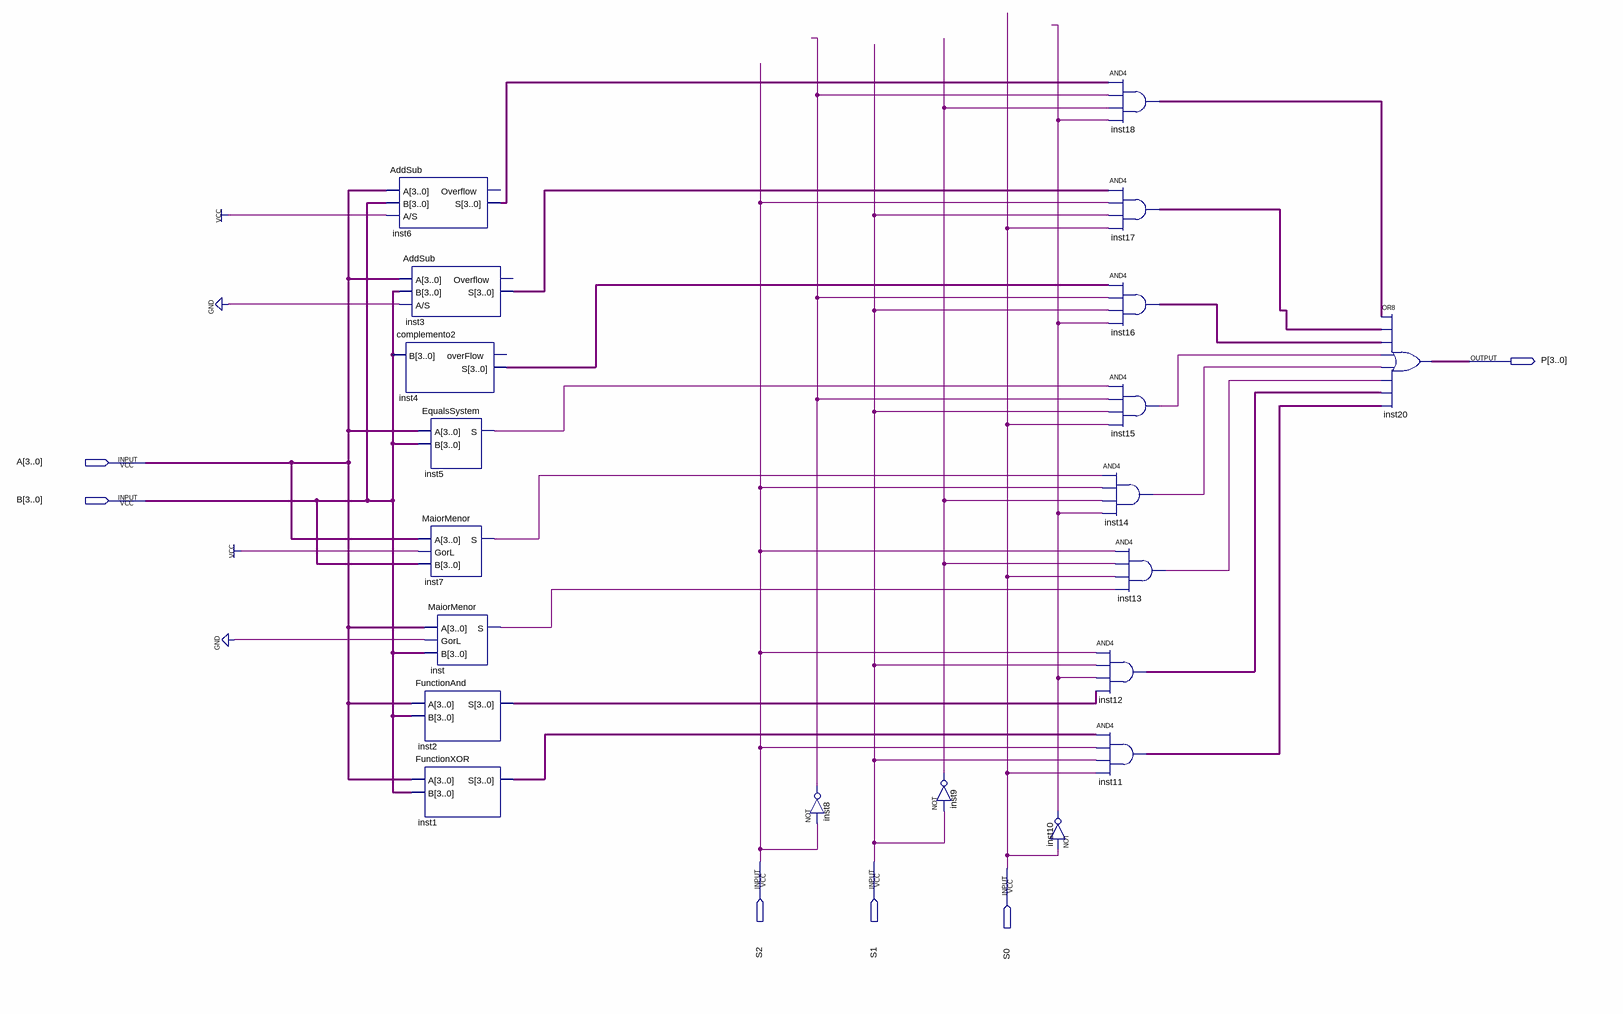
[diagram p0: schematic sheet]
// Quartus schematic Mux.bdf as structural Verilog: 20 symbols, 6 pins
module Mux (
  input  [3:0] A,
  input  [3:0] B,
  input  S2,
  input  S1,
  input  S0,
  output [3:0] P
);

  wire inst5_s, inst7_s, inst8_out, inst9_out, inst10_out, inst13_out, inst14_out, inst15_out, inst_s;
  wire [3:0] inst1_s, inst2_s, inst3_s, inst4_s, inst6_s, inst11_out, inst12_out, inst16_out, inst17_out,
       inst18_out;

  AddSub inst6 (.A(A), .B(B), .\A/S (1'b1), .S(inst6_s));  // open: Overflow
  AddSub inst3 (.A(A), .B(B), .\A/S (1'b0), .S(inst3_s));  // open: Overflow
  complemento2 inst4 (.B(B), .S(inst4_s));  // open: overFlow
  EqualsSystem inst5 (.A(A), .B(B), .S(inst5_s));
  MaiorMenor inst7 (.A(A), .GorL(1'b1), .B(B), .S(inst7_s));
  MaiorMenor inst (.A(A), .GorL(1'b0), .B(B), .S(inst_s));
  FunctionAnd inst2 (.A(A), .B(B), .S(inst2_s));
  FunctionXOR inst1 (.A(A), .B(B), .S(inst1_s));
  not inst8 (inst8_out, S2);
  not inst9 (inst9_out, S1);
  not inst10 (inst10_out, S0);
  assign inst18_out = inst6_s & {4{inst8_out}} & {4{inst9_out}} & {4{inst10_out}};  // AND4 inst18, 4 bits wide
  assign inst17_out = inst3_s & {4{S2}} & {4{S1}} & {4{S0}};  // AND4 inst17, 4 bits wide
  assign inst16_out = inst4_s & {4{inst8_out}} & {4{S1}} & {4{inst10_out}};  // AND4 inst16, 4 bits wide
  and inst15 (inst15_out, inst5_s, inst8_out, S1, S0);
  and inst14 (inst14_out, inst7_s, S2, inst9_out, inst10_out);
  assign inst12_out = {4{S2}} & {4{S1}} & {4{inst10_out}} & inst2_s;  // AND4 inst12, 4 bits wide
  assign inst11_out = inst1_s & {4{S2}} & {4{S1}} & {4{S0}};  // AND4 inst11, 4 bits wide
  and inst13 (inst13_out, S2, inst9_out, S0, inst_s);
  assign P = inst18_out | inst17_out | inst16_out | {4{inst15_out}} | {4{inst14_out}} | {4{inst13_out}} | inst12_out | inst11_out;  // OR8 inst20, 4 bits wide
endmodule
